# EAGLE schematic ttpcb (EAGLE 9.1.1)
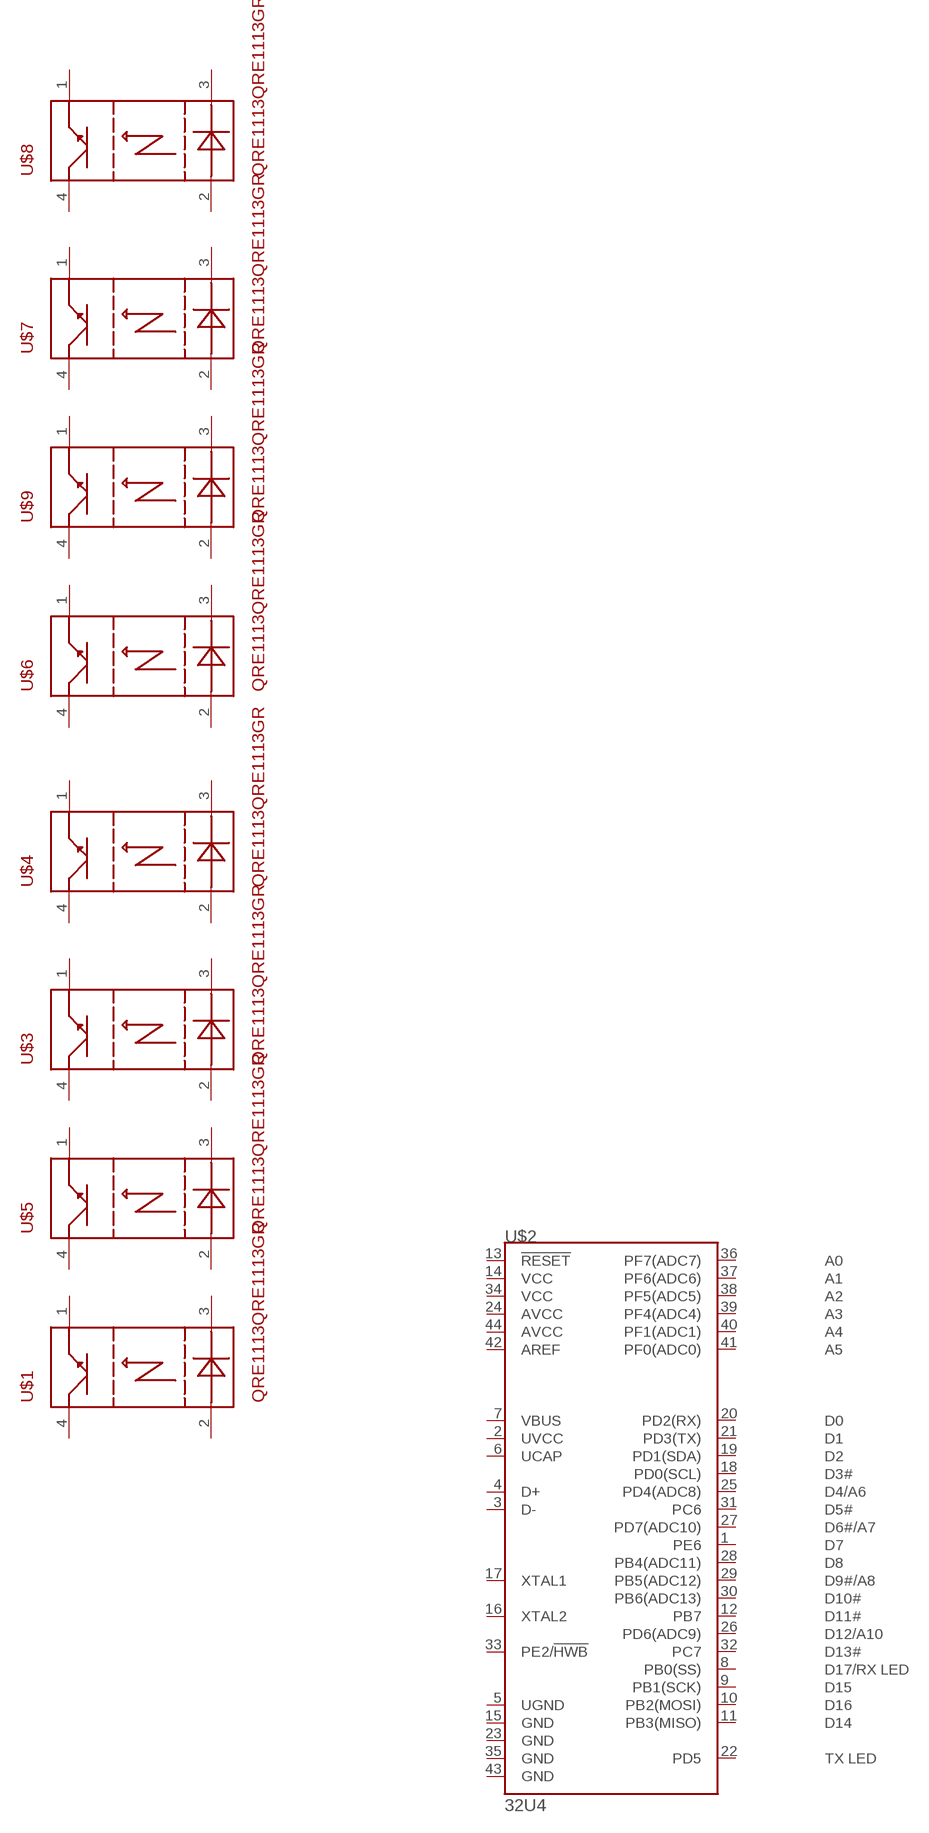
[diagram p0: schematic, sheet 1]

## Parts
U$1  QRE1113QRE1113GR  [QRE1113GR]
U$2  32U4  ATMEGA32U41:1  [QFN-44-NOPAD_1:1]
U$3  QRE1113QRE1113GR  [QRE1113GR]
U$4  QRE1113QRE1113GR  [QRE1113GR]
U$5  QRE1113QRE1113GR  [QRE1113GR]
U$6  QRE1113QRE1113GR  [QRE1113GR]
U$7  QRE1113QRE1113GR  [QRE1113GR]
U$8  QRE1113QRE1113GR  [QRE1113GR]
U$9  QRE1113QRE1113GR  [QRE1113GR]
Unconnected: U$1.1(E) U$1.2(A) U$1.3(K) U$1.4(C) U$2.1(PE6) U$2.2(UVCC) U$2.3(D-) U$2.4(D+) U$2.5(UGND) U$2.6(UCAP) U$2.7(VBUS) U$2.8(PB0(SS)) U$2.9(PB1(SCK)) U$2.10(PB2(MOSI)) U$2.11(PB3(MISO)) U$2.12(PB7) U$2.13(!RESET) U$2.14(VCC) U$2.15(GND) U$2.16(XTAL2) U$2.17(XTAL1) U$2.18(PD0(SCL)) U$2.19(PD1(SDA)) U$2.20(PD2(RX)) U$2.21(PD3(TX)) U$2.22(PD5) U$2.23(GND) U$2.24(AVCC) U$2.25(PD4(ADC8)) U$2.26(PD6(ADC9)) U$2.27(PD7(ADC10)) U$2.28(PB4(ADC11)) U$2.29(PB5(ADC12)) U$2.30(PB6(ADC13)) U$2.31(PC6) U$2.32(PC7) U$2.33(PE2/!HWB) U$2.34(VCC) U$2.35(GND) U$2.36(PF7(ADC7)) U$2.37(PF6(ADC6)) U$2.38(PF5(ADC5)) U$2.39(PF4(ADC4)) U$2.40(PF1(ADC1)) U$2.41(PF0(ADC0)) U$2.42(AREF) U$2.43(GND) U$2.44(AVCC) U$3.1(E) U$3.2(A) U$3.3(K) U$3.4(C) U$4.1(E) U$4.2(A) U$4.3(K) U$4.4(C) U$5.1(E) U$5.2(A) U$5.3(K) U$5.4(C) U$6.1(E) U$6.2(A) U$6.3(K) U$6.4(C) U$7.1(E) U$7.2(A) U$7.3(K) U$7.4(C) U$8.1(E) U$8.2(A) U$8.3(K) U$8.4(C) U$9.1(E) U$9.2(A) U$9.3(K) U$9.4(C)

## Library data of the parts
U$1 U$3-U$9 = TinyTony_ShenzenReady:QRE1113
U$2 = SparkFun-IC-Microcontroller:ATMEGA32U4: Atmel MCU, 32KByte Atmel 44-pin 8-bit Microcontroller with 32KBytes of ISP Flash and USB Controller Datasheet <http://cdn.sparkfun.com/datasheets/Dev/Arduino/Boards/ATMega32U4.pdf> SparkFun Products LilyPad Arduino USB - ATmega32U4 Board <https://www.sparkfun.com/products/12049> (DEV-12049) Pro Micro - 5V/16MHz <https://www.sparkfun.com/products/12640> (DEV-12640) Pro Micro - 3.3V/8MHz <https://www.sparkfun.com/products/12587> (DEV-12587) Fio v3 - ATmega32U4 <https://www.sparkfun.com/products/11520> (DEV-11520) Qduino Mini <https://www.sparkfun.com/products/13614> (DEV-13614) Makey Makey - Standard Kit <https://www.sparkfun.com/products/11511> (WIG-11511) Makey Makey Deluxe Kit <https://www.sparkfun.com/products/11519> (WIG-11519); PROD_ID: IC-10828